# EasyEDA Pro project ProPrj_英才杯B题_2024-10-28.epro, board PCB1
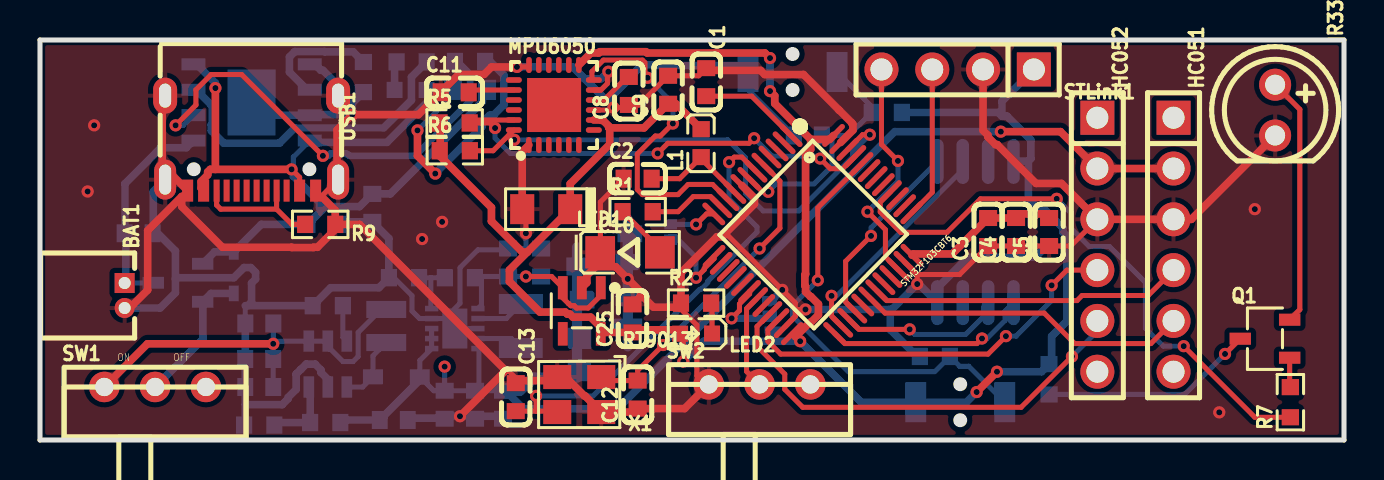
[diagram p1: board, top side]
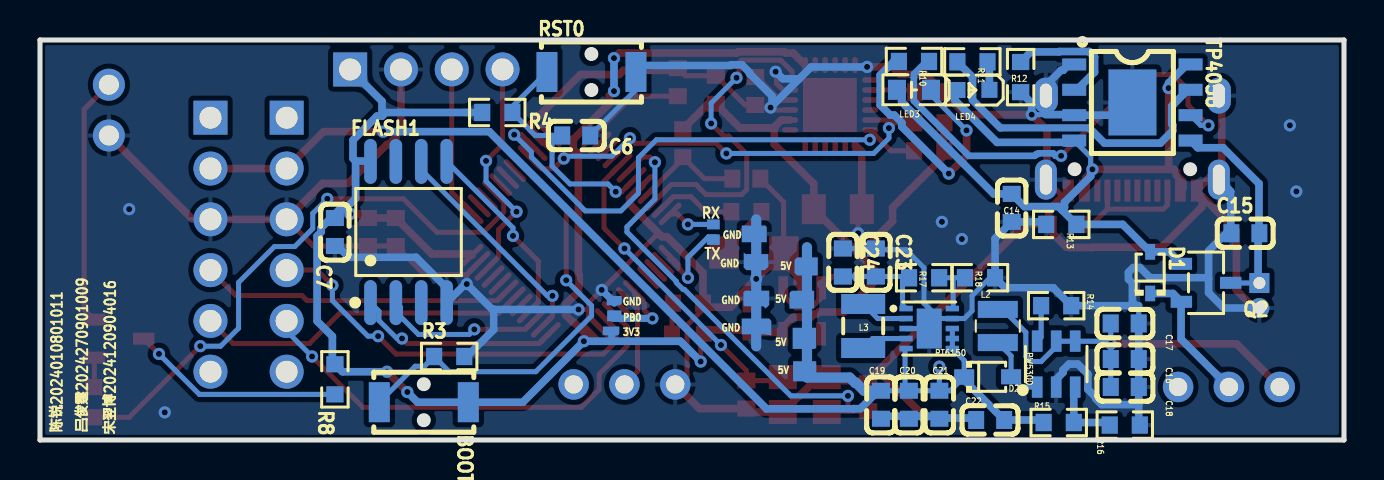
[diagram p2: board, bottom side, seen from below]

Outline 65.21 x 20 mm; copper layers: Top Layer, Bottom Layer. Coordinates in mm from the lower left corner of the outline.
Outline path: 0,20 0,0 65.21,0 65.21,20 0,20
Stack: Top Layer 0.035mm / Dielectric1 1.51mm FR4 er 4.5 / Bottom Layer 0.035mm

## Design rules (mm)
template: JLCPCB Capability(Two Layers Board)
spacing copperThickness1oz (default): track to track 0.102, other pairs 0.152 to 0.3
spacing copperThickness2oz: track to track 0.203, other pairs 0.152 to 0.3
track width copperThickness1oz (default): min 0.127, default 0.254, max 2.54
track width copperThickness2oz: min 0.203, default 0.254, max 2.54
differential pair differentialPair (default): width min 0.127, default 0.254, max 2.54; gap min 0.152, default 0.152
via viaSize (default): diameter min 0.5, default 0.61, max 10; hole min 0.3, default 0.305, max 6.3

## Placement (name value [footprint] x y rotation side)
BAT1  HC-1.25-2AW  [CONN-TH_2P-P1.25_HCTL_HC-1.25-2AW]  4.23 7.22 270 top
BOOT0  ZX-QC34-2TPDZ  [KEY-SMD_L3.9-W3.0-LS5.0-EH]  46.02 1.89 180 bottom
C1  100nF  [C0603]  33.32 17.89 270 top
C2  100nF  [C0603]  29.89 13.07 0 top
C3  100nF  [C0603]  47.41 10.4 90 top
C4  100nF  [C0603]  48.81 10.4 90 top
C5  100nF  [C0603]  50.46 10.4 90 top
C6  100nF  [C0603]  38.39 15.22 0 bottom
C7  100nF  [C0603]  50.46 10.4 90 bottom
C8  100nF  [C0603]  29.44 17.45 90 top
C9  100nF  [C0603]  31.41 17.51 90 top
C10  100nF  [CAP-SMD_L3.2-W1.6-FD]  25.31 11.54 180 top
C11  2.2uF  [C0603]  20.74 17.38 0 top
C12  12pF  [C0603]  29.89 2.27 90 top
C13  12pF  [C0603]  23.79 2.14 270 top
C14  10uF  [C0603]  16.62 11.61 90 bottom
C15  10uF  [C0603]  4.93 10.34 180 bottom
C16  100nF  [C0603]  10.96 4.05 0 bottom
C17  22uF  [C0603]  10.97 5.83 0 bottom
C18  22uF  [C0603]  10.96 2.65 0 bottom
C19  100nF  [C0603]  23.16 1.76 90 bottom
C20  22uF  [C0603]  21.76 1.76 90 bottom
C21  22uF  [C0603]  20.23 1.76 90 bottom
C22  10uF  [C0603]  17.69 1 180 bottom
C23  22uF  [C0603]  23.41 8.88 270 bottom
C24  1uF  [C0603]  25.06 8.88 270 bottom
C25  1uF  [C0603]  29.63 6.08 90 top
D1  B5817WS  [SOD-323_L1.7-W1.3-LS2.5-FD]  9.69 8.37 270 bottom
D2  1N5819WS  [SOD-323_L1.8-W1.3-LS2.5-RD]  17.82 3.16 180 bottom
FLASH1  W25Q16JVSSIQ  [SOIC-8_L5.3-W5.3-P1.27-LS8.0-BL]  46.78 10.4 180 bottom
HC051  PZ254V-11-06P  [HDR-TH_6P-P2.54-V-M]  56.68 9.76 270 top
HC052  PZ254V-11-06P  [HDR-TH_6P-P2.54-V-M]  52.87 9.76 270 top
IR333C  IR333C-A(BY)(Q)  [LED-TH_BD5.0-P2.54-FD]  61.76 16.49 270 top
L1  CBG160808U000T  [L0603]  33.06 14.84 90 top
L2  4.7uH  [IND-SMD_L2.5-W2.0-VLS252012CX-150M]  17.31 5.7 270 bottom
L3  2.2uH  [IND-SMD_L2.5-W2.0_MHCHL2520]  24.04 5.7 90 bottom
LED1  NCD1206R1  [LED1206-R-RD_RED]  29.51 9.38 0 top
LED2  NCD0603R1  [LED0603-RD_RED]  32.81 5.32 180 top
LED3  NCD0603G1  [led0603-rd_1]  21.5 17.51 0 bottom
LED4  NCD0603R1  [LED0603-RD_RED]  18.53 17.5 0 bottom
MPU6050  MPU-6050  [QFN-24_L4.0-W4.0-P0.50-BL-EP2.7]  25.7 16.75 0 top
NOREF  -  [Pad_e13922]  29.4 8.89 0 top
NOREF#2  -  [Pad_e13907]  26.98 5.08 0 top
NOREF#3  -  [Pad_e97]  36.65 5.45 0 top
NOREF#4  -  [Pad_e13924]  29.49 10.31 0 top
NOREF#5  -  [Pad_e13910]  29.38 5.68 0 top
NOREF#6  -  [Pad_e95]  36.49 6.97 0 top
NOREF#7  -  [Pad_e13905]  26.9 8.68 0 top
NOREF#8  -  [Pad_e13908]  26.97 3.44 0 top
NOREF#9  -  [Pad_e13906]  27.11 7.02 0 top
NOREF#10  -  [Pad_e96]  36.49 6.21 0 top
NOREF#11  -  [Pad_e13909]  29.39 7.08 0 top
NOREF#12  -  [Pad_e13888]  31.54 10.78 0 top
NOREF#13  -  [Pad_e13889]  31.54 10.02 0 top
PW5300  PW5300  [SOT-23-6_L2.9-W1.6-P0.95-LS2.8-BL]  14.39 3.8 180 bottom
Q1  S8050  [SOT-23-3_L2.9-W1.6-P1.90-LS2.8-BR]  61.26 5.06 0 top
Q2  CJ3401  [SOT-23-3_L2.9-W1.6-P1.90-LS2.8-BR]  6.9 7.86 0 bottom
R1  470Ω  [R0603]  29.89 11.41 0 top
R2  4.7kΩ  [R0603]  32.81 6.84 0 top
R3  10kΩ  [R0603]  44.74 4.18 180 bottom
R4  10kΩ  [R0603]  42.34 16.38 0 bottom
R5  4.7kΩ  [R0603]  20.73 15.85 0 top
R6  4.7kΩ  [R0603]  20.74 14.46 0 top
R7  1kΩ  [R0603]  62.52 1.89 90 top
R8  100Ω  [R0603]  50.46 3.03 90 bottom
R9  5.1kΩ  [R0603]  14.01 10.78 180 top
R10  4.7kΩ  [R0603]  21.5 18.93 0 bottom
R11  4.7kΩ  [R0603]  18.58 18.91 180 bottom
R12  4.7kΩ  [R0603]  16.17 18.15 90 bottom
R13  10kΩ  [R0603]  14.14 10.78 180 bottom
R14  30kΩ  [R0603]  14.39 6.72 0 bottom
R15  88.7kΩ  [R0603]  14.27 0.87 0 bottom
R16  12kΩ  [R0603]  10.96 0.75 0 bottom
R17  487kΩ  [R0603]  21 8.11 0 bottom
R18  86.6kΩ  [R0603]  18.2 8.11 0 bottom
RST0  ZX-QC34-2TPDZ  [KEY-SMD_L3.9-W3.0-LS5.0-EH]  37.63 18.4 180 bottom
RT6150  RT6150BGQW  [WSON-10_L2.5-W2.5-P0.50-BL-EP]  20.74 5.57 270 bottom
RT9013  RT9013-33GB  [SOT-23-5_L3.0-W1.7-P0.95-LS2.8-BL]  27.09 6.46 180 top
STLink1  PZ254V-11-04P  [HDR-TH_4P-P2.54-V-M]  45.89 18.53 180 top
STM32F103CBT6  STM32F103CBT6  [LQFP-48_L7.0-W7.0-P0.50-LS9.0-BL]  38.65 10.27 225.3 top
SW1  TA-3522-A3  [SW-TH_3P-L9.1-W3.5-P2.50-A3]  5.76 2.65 0 top
SW2  TA-3522-A3  [SW-TH_3P-L9.1-W3.5-P2.50-A3]  35.98 2.78 0 top
TP4056  TP4056-42-ESOP8  [ESOP-8_L4.9-W3.9-P1.27-LS6.0-BL-EP]  10.58 16.88 270 bottom
USB1  TYPE-C 16PIN 2MD(073)  [USB-C-SMD_TYPE-C-6PIN-2MD-073]  10.58 14.84 180 top
X1  8MHz  [OSC-SMD_4P-L3.2-W2.5-BL]  26.96 2.27 180 top

## Footprints (pads in the part's own frame, mm; a bottom-side part is the same pattern mirrored in y, then rotated)
C0603
  rect 0.8x0.9 smd: 1(-0.7,0) 2(0.7,0)
CAP-SMD_L3.2-W1.6-FD
  rect 1.2x1.5 smd: 1(-1.2,0) 2(1.2,0)
CONN-TH_2P-P1.25_HCTL_HC-1.25-2AW
  rect 1x1 hole 0.6: 1(-0.625,0)
  round 1 hole 0.6: 2(0.625,0)
ESOP-8_L4.9-W3.9-P1.27-LS6.0-BL-EP
  rect 0.6x1.2 smd: 1(-1.905,-2.909) 2(-0.635,-2.909) 3(0.635,-2.909) 4(1.905,-2.909) 5(1.905,2.909) 6(0.635,2.909) 7(-0.635,2.909) 8(-1.905,2.909)
  rect 3.3x2.4 smd: 9(0,0)
HDR-TH_4P-P2.54-V-M
  rect 1.7x1.7 hole 1.1: 1(-3.81,0)
  round 1.7 hole 1.1: 2(-1.27,0) 3(1.27,0) 4(3.81,0)
HDR-TH_6P-P2.54-V-M
  rect 1.7x1.7 hole 1.1: 1(-6.35,0)
  round 1.7 hole 1.1: 2(-3.81,0) 3(-1.27,0) 4(1.27,0) 5(3.81,0) 6(6.35,0)
IND-SMD_L2.5-W2.0-VLS252012CX-150M
  rect 0.85x2 smd: 1(-0.83,0) 2(0.83,0)
IND-SMD_L2.5-W2.0_MHCHL2520
  rect 1x2.2 smd: 1(-1.1,0) 2(1.1,0)
KEY-SMD_L3.9-W3.0-LS5.0-EH
  rect 1.05x2 smd: 1(-2.225,0) 2(2.225,0)
L0603
  rect 0.8x0.864 smd: 1(-0.7,0) 2(0.7,0)
led0603-rd_1
  rect 0.9x1 smd: 1(-0.85,0) 2(0.85,0)
LED0603-RD_RED
  rect 0.8x0.8 smd: 1(-0.799,-0.004) 2(0.799,0.004)
LED1206-R-RD_RED
  rect 1.485x1.62 smd: 1(1.492,0) 2(-1.492,0)
LED-TH_BD5.0-P2.54-FD
  round 1.6 hole 1: 1(-1.27,0) 2(1.27,0)
LQFP-48_L7.0-W7.0-P0.50-LS9.0-BL
  oval 0.27x1.5 smd: 1(-2.75,-4.25) 2(-2.25,-4.25) 3(-1.75,-4.25) 4(-1.25,-4.25) 5(-0.75,-4.25) 6(-0.25,-4.25) 7(0.25,-4.25) 8(0.75,-4.25) 9(1.25,-4.25) 10(1.75,-4.25) 11(2.25,-4.25) 12(2.75,-4.25) 25(2.75,4.25) 26(2.25,4.25) 27(1.75,4.25) 28(1.25,4.25) 29(0.75,4.25) 30(0.25,4.25) 31(-0.25,4.25) 32(-0.75,4.25) 33(-1.25,4.25) 34(-1.75,4.25) 35(-2.25,4.25) 36(-2.75,4.25)
  oval 1.5x0.27 smd: 13(4.25,-2.75) 14(4.25,-2.25) 15(4.25,-1.75) 16(4.25,-1.25) 17(4.25,-0.75) 18(4.25,-0.25) 19(4.25,0.25) 20(4.25,0.75) 21(4.25,1.25) 22(4.25,1.75) 23(4.25,2.25) 24(4.25,2.75) 37(-4.25,2.75) 38(-4.25,2.25) 39(-4.25,1.75) 40(-4.25,1.25) 41(-4.25,0.75) 42(-4.25,0.25) 43(-4.25,-0.25) 44(-4.25,-0.75) 45(-4.25,-1.25) 46(-4.25,-1.75) 47(-4.25,-2.25) 48(-4.25,-2.75)
OSC-SMD_4P-L3.2-W2.5-BL
  rect 1.4x1.2 smd: 1(-1.1,-0.875) 2(1.1,-0.875) 3(1.1,0.875) 4(-1.1,0.875)
Pad_e95
  custom 0.754x0.467 smd far side: 1(0,0)
Pad_e96
  custom 0.711x0.544 smd far side: 58(0,0)
Pad_e97
  custom 0.836x0.446 smd far side: 59(0,0)
Pad_e13888
  custom 0.635x0.508 smd far side: 1(0,0)
Pad_e13889
  custom 0.643x0.524 smd far side: 49(0,0)
Pad_e13905
  custom 1.155x0.903 smd far side: 50(0,0)
Pad_e13906
  custom 1.232x0.889 smd far side: 51(0,0)
Pad_e13907
  custom 1.175x1.054 smd far side: 52(0,0)
Pad_e13908
  custom 1.155x0.994 smd far side: 53(0,0)
Pad_e13909
  custom 1.289x0.895 smd far side: 54(0,0)
Pad_e13910
  custom 1.48x0.843 smd far side: 55(0,0)
Pad_e13922
  custom 1.232x0.889 smd far side: 56(0,0)
Pad_e13924
  custom 1.243x0.833 smd far side: 57(0,0)
QFN-24_L4.0-W4.0-P0.50-BL-EP2.7
  oval 0.28x0.8 smd: 1(-1.25,-2) 2(-0.75,-2) 3(-0.25,-2) 4(0.25,-2) 5(0.75,-2) 6(1.25,-2) 13(1.25,2) 14(0.75,2) 15(0.25,2) 16(-0.25,2) 17(-0.75,2) 18(-1.242,2)
  oval 0.8x0.28 smd: 7(2,-1.25) 8(2,-0.75) 9(2,-0.25) 10(2,0.25) 11(2,0.75) 12(2,1.25) 19(-2,1.25) 20(-2,0.75) 21(-2,0.25) 22(-2,-0.25) 23(-2,-0.75) 24(-2,-1.25)
  rect 2.7x2.7 smd: 25(0.013,0)
R0603
  rect 0.806x0.864 smd: 1(-0.753,0) 2(0.753,0)
SOD-323_L1.7-W1.3-LS2.5-FD
  rect 0.78x0.5 smd: 1(-1.04,0) 2(1.04,0)
SOD-323_L1.8-W1.3-LS2.5-RD
  rect 1x0.75 smd: 1(-1.173,0) 2(1.173,0)
SOIC-8_L5.3-W5.3-P1.27-LS8.0-BL
  oval 0.63x2.25 smd: 1(-1.905,-3.53) 2(-0.635,-3.53) 3(0.635,-3.53) 4(1.905,-3.53) 5(1.905,3.53) 6(0.635,3.53) 7(-0.635,3.53) 8(-1.905,3.53)
SOT-23-3_L2.9-W1.6-P1.90-LS2.8-BR
  rect 1.07x0.6 smd: 1(1.235,-0.95) 2(1.235,0.95) 3(-1.235,0)
SOT-23-5_L3.0-W1.7-P0.95-LS2.8-BL
  rect 0.49x1.157 smd: 1(-0.95,-1.153) 2(0,-1.153) 3(0.95,-1.153)
  rect 0.49x1.175 smd: 4(0.95,1.153) 5(-0.95,1.153)
SOT-23-6_L2.9-W1.6-P0.95-LS2.8-BL
  rect 0.532x1.072 smd: 1(-0.95,-1.149) 2(0,-1.149) 3(0.95,-1.149) 4(0.95,1.149) 5(0,1.149) 6(-0.95,1.149)
SW-TH_3P-L9.1-W3.5-P2.50-A3
  round 1.524 hole 0.914: 1(-2.54,0) 2(0,0) 3(2.54,0)
USB-C-SMD_TYPE-C-6PIN-2MD-073
  rect 0.55x1.1 smd: 1(-3.2,2.375) 2(-2.4,2.375) 11(2.4,2.375) 12(3.2,2.375)
  rect 0.3x1.1 smd: 3(-1.75,2.375) 4(-1.25,2.375) 5(-0.75,2.375) 6(-0.25,2.375) 7(0.25,2.375) 8(0.75,2.375) 9(1.25,2.375) 10(1.75,2.375)
  oval 1.1x2 hole 0.6x1.5: 13(-4.325,1.825) 14(4.325,1.825)
  oval 1.2x1.8 hole 0.6x1.2: 13(-4.325,-2.375) 14(4.325,-2.375)
WSON-10_L2.5-W2.5-P0.50-BL-EP
  rect 0.28x0.665 smd: 1(-1,-1.157) 2(-0.5,-1.157) 3(0,-1.157) 4(0.5,-1.157) 5(1,-1.157) 6(1,1.157) 7(0.5,1.157) 8(0,1.157) 9(-0.5,1.157) 10(-1,1.157)
  rect 2x1.25 smd: 11(0,0)

## Nets
As in the schematic, except:
3V3: BOOT0.2 C3.2 C4.2 C5.2 C7.2 C9.1 C10.1 C25.1 FLASH1.8 L1.2 LED2.2 MPU6050.8 MPU6050.13 NOREF#3.59 R4.2 R5.1 R6.1 R8.2 RT9013.5 STLink1.1 STM32F103CBT6.24 STM32F103CBT6.36 STM32F103CBT6.48
+5V: C19.2 C20.2 C21.2 C22.2 D2.1 HC051.2 HC052.2 NOREF#2.52 NOREF#7.50 NOREF#8.53 NOREF#9.51 R15.2 RT6150.5 RT6150.6 RT6150.7 RT6150.8
GND: BAT1.2 C1.1 C2.1 C3.1 C4.1 C5.1 C6.1 C7.1 C8.1 C9.2 C10.2 C11.1 C12.1 C13.1 C14.1 C15.1 C16.1 C17.1 C18.1 C19.1 C20.1 C21.1 C22.1 C23.1 C24.1 C25.2 FLASH1.4 HC051.3 HC052.3 IR333C.2 LED1.2 MPU6050.1 MPU6050.9 MPU6050.11 MPU6050.18 NOREF.56 NOREF#4.57 NOREF#5.55 NOREF#6.1 NOREF#11.54 PW5300.2 R2.1 R3.2 R9.1 R12.1 R13.1 R14.1 R16.1 R18.1 RST0.2 RT6150.3 RT6150.9 RT6150.11 RT9013.2 STLink1.2 STM32F103CBT6.8 STM32F103CBT6.23 STM32F103CBT6.35 STM32F103CBT6.47 SW2.1 TP4056.1 TP4056.3 TP4056.9 USB1.1 USB1.12 USB1.13 USB1.14 X1.2 X1.4
$1N10982: NOREF#12.1 STM32F103CBT6.12
$1N10986: NOREF#13.49 STM32F103CBT6.13
$1N11000: NOREF#10.58 STM32F103CBT6.18

Pads without a net: FLASH1 3 7; HC051 1 6; HC052 1 6; MPU6050 2 3 4 5 6 7 14 15 16 17 19 21 22 25; RT9013 4; STM32F103CBT6 2 3 4 14 15 16 17 20 32 33 38 39 41 42 43; SW1 3; SW2 3; USB1 3 5 6 7 8 9

## Via types
v1: diameter 0.61, hole 0.305, Top Layer to Bottom Layer, 62 vias

## Routing (per net, layer and track width the routed paths; a pad name or vN(x,y) marks a point on that pad's centre or on a via; arc(x,y) is an arc through that point)
3V3: length 116.5
  Top Layer w0.249: 32.04,5.29 32.17,5.15 v1(32.17,3.92) ; v1(38.01,4.94) 38,4.94 37.77,5.16 37.62,5.32
  Top Layer w0.254: RT9013.5 28.11,5.38 28.3,5.38
  Top Layer w0.381: v1(36.51,17.44) 36.74,17.21 36.74,16.83 38.54,15.03 ; 24.37,9.4 23.47,8.5 23.47,7.92 25,6.4 26.27,6.4 26.37,6.3 26.5,6.3 26.65,6.14 27.54,6.14 28.3,5.38 C25.1 29.76,5.51 31.94,5.51 32.01,5.44 LED2.2 ; 24.37,9.4 24.12,9.4 22.57,10.94 22.57,11.62 20.02,14.18 20.02,15.82 R5.1 ; 24.37,9.4 C10.1 26.51,12.81 28.49,14.79 28.49,15.57 28.46,15.61 ; v1(36.51,19.09) 36.25,19.35 30.36,19.35 30.3,19.41 28,19.41 27.93,19.35 27.55,19.35 MPU6050.13 ; 38.54,15.03 38.54,14.52 38.28,14.27 38.28,8.29 38.25,8.25 38.25,7.72 38.28,7.68 38.28,7.41 38.52,7.17 38.55,7.17 38.92,6.79 38.92,6.26 38.55,5.88 38.5,5.88 37.77,5.16 ; 38.54,15.03 39.48,15.03 STM32F103CBT6.48 ; 28.46,15.61 30.2,15.61 C9.1 31.79,16.81 L1.2 ; 28.46,15.61 28.44,15.63 28.44,15.7 28.16,15.98 28.08,15.98 28.06,16 MPU6050.8 ; v1(46.84,2.4) v1(47.85,3.41) ; 43.61,9.24 43.67,9.3 45.62,9.3 C3.2 C4.2 49.02,11.3 v1(49.69,11.3) 50.25,11.3 C5.2
  Bottom Layer w0.254: 49.94,11.56 v1(49.69,11.3)
  Bottom Layer w0.355: 36.55,4.94 36.62,5 36.62,5.45
  Bottom Layer w0.381: 49.43,13.95 49.55,14.07 49.55,15 48.36,16.19 48.1,16.19 ; 49.43,13.95 49.43,12.08 49.94,11.56 50.2,11.56 51.15,10.61 51.15,10.4 51.35,10.2 51.35,5.95 50.59,5.18 50.59,3.91 R8.2 50.09,3.41 v1(47.85,3.41) ; 49.43,13.95 48.7,13.95 FLASH1.8 ; v1(32.17,3.92) 33.19,4.94 v1(38.01,4.94) 41.06,1.89 BOOT0.2 46.33,1.89 v1(46.84,2.4) ; 48.1,16.19 47.92,16.38 R4.2 ; 48.1,16.19 48.1,16.93 STLink1.1 ; v1(36.51,17.44) v1(36.51,19.09)
+5V: length 66.2
  Top Layer w0.381: HC051.2 HC052.2 51.03,15.42 v1(48.05,15.42)
  Bottom Layer w0.252: D2.1 18.99,3.98 RT6150.6 RT6150.7 RT6150.8 ; RT6150.5 21.95,4.52 21.95,2.46
  Bottom Layer w0.254: C19.2 C20.2 C21.2 ; C21.2 19.69,2.46 D2.1 ; C21.2 v1(20.23,3.67)
  Bottom Layer w0.381: v1(48.05,15.42) 42.74,15.42 28.88,1.56 24.54,1.56 24.53,1.56 24.18,1.56 23.28,2.46 C19.2 ; 19.2,2.96 18.95,2.96 C22.2 15.15,1 R15.2
  Bottom Layer w0.508: 23.28,2.46 24,2.46 24.39,2.85 24.45,2.85 24.72,3.12 26.85,3.12 26.85,9.64
GND: length 265.1
  Top Layer w0.249: 34.15,10.21 34.42,10.21 v1(37.12,7.51) 37.77,6.85 37.77,6.53 ; 37.77,6.53 37.77,6.18 STM32F103CBT6.23 ; 37.77,6.53 v1(38.28,6.53) ; v1(43.87,7.8) 43.87,8.27 STM32F103CBT6.35
  Top Layer w0.252: MPU6050.18 24.36,18.65 v1(23.85,18.65) ; C8.1 29.31,16.62 v1(28.67,16.62) 28.55,16.5 MPU6050.9 ; 23.29,3.47 23.41,3.47 23.92,2.97
  Top Layer w0.254: 25.56,2.97 25.74,3.15 X1.2 ; 43.87,8.27 45.98,8.27 C3.1 C4.1 C5.1 51.54,9.7 HC052.3 ; USB1.13 14.85,12.97 14.09,12.2 14.09,12.16 USB1.1 ; C8.1 29.95,16.75 C9.2 32.93,18.21 C1.1 ; C2.1 28.02,11.9 28.02,9.37 LED1.2 ; C10.2 24.3,11.36 v1(24.3,10.34) ; R2.1 32,6.59 32.85,5.74 32.85,3.2 33.36,2.69 SW2.1 ; 7.09,12.18 USB1.12 ; v1(28.42,18.41) 28.37,18.37 28.37,17.83 28.05,17.5 MPU6050.11
  Top Layer w0.381: 33.2,18.48 36.03,18.48 36.24,18.27 38.18,18.27 39.96,16.49 ; 39.95,16.49 39.96,16.49 ; 39.96,16.49 40.59,15.86 40.59,15.85 40.65,15.79 40.65,15.49 STM32F103CBT6.47 ; 14.09,12.16 14.76,11.49 R9.1 ; 35.1,12.73 35.73,12.1 35.73,11.8 35.1,11.17 35.1,11.16 34.15,10.21 34.1,10.16 33.85,10.16 32.05,8.37 R2.1 ; 30.19,7.13 29.98,7.13 C25.2 ; 30.19,7.13 30.19,7.26 v1(29.39,8.05) 28.78,8.66 27.78,8.66 27.35,8.23 27.35,7.87 RT9013.2 ; 30.19,7.13 30.68,6.64 31.95,6.64 32,6.59 ; USB1.14 6.11,17.07 6.11,13.74 USB1.12 ; R9.1 14.76,10.53 13.88,9.64 13.69,9.64 13.68,9.62 12.59,9.62 12.57,9.64 9.12,9.64 7.09,11.67 7.09,12.18 5.38,10.47 5.38,7.5 4.49,6.6 BAT1.2 ; R9.1 15.98,10.78 23.29,3.47 v1(21,1.19) ; STLink1.2 47.16,15.48 47.4,15.24 47.4,15.15 47.78,14.77 47.87,14.77 49.81,12.83 51.08,12.83 HC052.3 HC051.3 57.57,11.03 IR333C.2 ; X1.2 25.98,3.03 26.39,3.03 27.22,2.2 27.26,2.2 28.07,1.4 29.71,1.4 C12.1 32.23,1.57 33.36,2.69 ; 23.92,2.97 25.56,2.97 ; C10.2 24.11,14.42 MPU6050.1 ; 14.85,12.97 14.85,15.51 v1(15.62,16.27) 18.92,16.27 C11.1 20.94,18.28 22.21,18.28 22.58,18.65 v1(23.85,18.65)
  Bottom Layer w0.249: 44.78,6.96 FLASH1.4
  Bottom Layer w0.252: 28.6,16.69 v1(28.67,16.62) ; 20.24,6.07 RT6150.9 18.98,6.07 18.6,6.45 18.6,7.22 17.7,8.11 R18.1 ; 20.24,6.07 21,6.83 21,8.61 21.9,9.51 23.35,9.51 C23.1 ; 20.24,6.07 RT6150.11 RT6150.3
  Bottom Layer w0.254: 21.76,1.19 C20.1 ; RST0.2 35.41,17.51 C6.1 ; 10.27,6.72 C17.1 ; C23.1 24.3,9.58 ; 24.3,9.58 C24.1 ; 24.3,9.58 v1(24.3,10.34) ; USB1.13 14.92,17.21 14.92,16.27 v1(15.62,16.27)
  Bottom Layer w0.355: 36.49,6.84 36.49,6.88 v1(37.12,7.51)
  Bottom Layer w0.381: 10.27,1.77 10.27,0.8 R16.1 ; 10.27,1.77 C17.1 ; 10.27,1.77 12.11,1.77 12.41,2.06 12.41,2.13 12.81,2.53 12.81,3.29 12.83,3.32 12.83,3.32 13.03,3.52 13.04,3.52 13.31,3.8 13.76,3.8 14.05,3.5 14.05,3.37 14.39,3.03 PW5300.2 ; 27.24,18.06 26.64,18.65 v1(23.85,18.65) ; 27.24,18.06 28.07,18.06 v1(28.42,18.41) ; 27.24,18.06 28.6,16.69 28.6,17.2 29.73,18.33 29.73,18.38 30.11,18.76 30.64,18.76 30.68,18.73 35.08,18.73 RST0.2 ; R13.1 15.02,10.91 C14.1 17.45,10.07 R18.1 16.95,7.61 14.54,7.61 R14.1 10.39,6.72 ; R12.1 15.62,16.84 v1(15.62,16.27) ; 6.77,8.06 6.77,7.36 6.01,6.6 BAT1.2 ; 6.77,8.06 6.77,9.45 5.67,10.56 5.67,12.43 USB1.14 ; 6.77,8.06 6.83,8.11 9.69,8.11 10.2,8.62 10.54,8.62 10.78,8.38 10.78,8.04 10.58,7.84 10.58,6.9 10.39,6.72 ; 42.52,6.53 42.6,6.53 v1(43.87,7.8) 43.94,7.8 44.78,6.96 44.78,7.52 46.4,9.14 49.77,9.14 50.33,9.7 C5.1 ; 42.52,6.53 42.52,5.52 43.86,4.18 R3.2 ; 42.52,6.53 v1(38.28,6.53) ; 14.92,17.21 15.04,17.34 15.04,17.59 14.15,18.49 14.04,18.49 13.74,18.78 TP4056.1 ; 14.92,16.27 13.52,16.27 13.49,16.24 11.22,16.24 TP4056.9 ; 10.39,6.72 10.27,6.72 ; C19.1 23.03,1.19 v1(21,1.19) 20.36,1.19 20.27,1.1 18.49,1.1 C22.1
  Bottom Layer w0.508: 29.39,4.68 v1(29.39,8.05) 29.39,11.03
  vias: v1(2.38,12.43) v1(2.71,15.73) v1(19.11,10.05) v1(20.11,10.91) v1(58.97,1.38) v1(60.75,11.54)
VBAT_E: length 5.1
  Top Layer w0.249: C1.2 35.58,17.19 STM32F103CBT6.1
VCC_USB: length 42.4
  Top Layer w0.254: USB1.2 12.98,13.13 v1(12.58,13.53)
  Top Layer w0.381: 8.77,13.53 v1(8.77,17.6) ; 8.77,13.53 v1(12.58,13.53) ; 8.77,13.53 8.52,13.53 8.38,13.4 8.38,13.25 8.05,12.92 8.05,12.6 USB1.11
  Bottom Layer w0.254: TP4056.4 12.67,14.15 12.67,13.44 v1(12.58,13.53)
  Bottom Layer w0.381: 14.11,11.5 14.27,11.67 15.98,11.67 C14.2 17.52,12.31 21.93,16.72 21.93,16.73 22.12,16.92 22.12,17.28 LED3.2 ; 14.11,11.5 13.98,11.63 13.98,11.88 12.67,13.19 12.67,13.44 ; 14.11,11.5 R13.2 11.07,10.78 D1.1 8.73,9.41 Q2.1 ; 19.33,17.5 19.46,17.37 19.46,16.99 17.35,14.88 13.9,14.88 13.87,14.84 13.62,14.84 TP4056.4 ; v1(8.77,17.6) 8.77,17.85 7.87,18.75 7.71,18.75 TP4056.8
BOOT0: length 22.1
  Top Layer w0.249: v1(38.89,7.99) 38.89,11.61 STM32F103CBT6.44
  Bottom Layer w0.249: R3.1 44.74,3.41 40.42,3.41 37.62,6.21 37.62,6.72 v1(38.89,7.99)
  Bottom Layer w0.254: BOOT0.1 46.44,3.69 45.99,3.69 R3.1
EXIT0_6050: length 16.4
  Top Layer w0.249: 34.4,12.02 33.63,12.78 32.41,12.78 31.9,12.27 30.12,12.27 29.87,12.52 29.87,14.3 30.77,15.2 31.02,15.2 v1(31.65,15.83) ; v1(30.38,18.11) 30.25,18.24 30.25,18.87 30.13,19 28.17,19 27.6,18.42 27.6,18.09 MPU6050.12
  Bottom Layer w0.249: v1(31.65,15.83) 31.65,16.84 v1(30.38,18.11)
I2C1_SCL: length 23.7
  Top Layer w0.249: v1(30.88,14.33) 31.39,14.84 35.46,14.84 v1(35.71,15.09) ; v1(22.76,15.6) 22.5,15.85 R5.2 ; STM32F103CBT6.45 40.14,13.57 39.52,13.57 v1(39.01,14.07)
  Top Layer w0.252: R5.2 21.63,16 MPU6050.23
  Bottom Layer w0.249: v1(39.01,14.07) 38.89,14.19 36.61,14.19 v1(35.71,15.09) ; v1(30.88,14.33) 23.52,14.33 22.76,15.09 v1(22.76,15.6)
I2C1_SDA: length 26.4
  Top Layer w0.249: 23.46,15.27 v1(23.71,15.01) ; 40.39,14.52 41.13,15.27 v1(41.49,15.27)
  Top Layer w0.252: R6.2 22.66,14.46 MPU6050.24
  Bottom Layer w0.249: v1(41.49,15.27) 40.63,14.4 40.63,14.15 37.94,11.45 36.16,11.45 35.28,12.33 35.28,14.11 34.38,15.01 v1(23.71,15.01)
IR: length 29.2
  Top Layer w0.249: v1(50.84,12.06) 47.03,12.06 45.36,10.38 43.03,10.38 42.02,11.4 42.02,11.91 STM32F103CBT6.40 ; R7.1 60.75,1.14 v1(57.19,4.69)
  Bottom Layer w0.249: v1(57.19,4.69) 56.17,4.69 55.28,5.59 55.28,7.88 53.48,9.67 52.46,9.67 51.57,10.57 51.57,11.33 v1(50.84,12.06)
NRST: length 12.2
  Top Layer w0.249: v1(36.42,12.41) 36.12,12.41 STM32F103CBT6.7
  Bottom Layer w0.249: 39.6,15.22 39.6,13.7 38.7,12.8 36.81,12.8 v1(36.42,12.41)
  Bottom Layer w0.254: C6.2 40.44,15.22 41.59,16.38 41.59,16.67 RST0.1
OSC_IN: length 16
  Top Layer w0.249: STM32F103CBT6.5 37,12.95 37,10.59 v1(35.98,9.58) ; v1(31.16,4.75) 29.89,3.48 C12.2
  Top Layer w0.254: 28.07,3.15 28.24,2.97 C12.2
  Bottom Layer w0.249: v1(31.16,4.75) v1(35.98,9.58)
OSC_OUT: length 23
  Top Layer w0.249: v1(34.46,13.89) 34.71,14.14 35.1,14.14 STM32F103CBT6.6 ; 24.81,1.44 v1(24.81,2.21)
  Top Layer w0.254: X1.3 25.82,1.44 23.92,1.44
  Bottom Layer w0.254: v1(24.81,2.21) 27.66,2.21 32.98,7.53 33.05,7.53 33.39,7.87 33.39,7.94 35.86,10.4 35.86,10.65 34.46,12.05 v1(34.46,13.89)
PA1_LED: length 3.9
  Top Layer w0.249: 34.05,11.66 33.54,12.17 32.66,12.17 31.91,11.41 R1.2
PB1: length 4.8
  Top Layer w0.249: 35.84,7.07 35.33,6.57 35.33,3.43 SW2.2
SPI2_MISO: length 8.2
  Top Layer w0.249: v1(43.49,5.53) 40.95,5.53 STM32F103CBT6.27
  Bottom Layer w0.249: v1(43.49,5.53) 43.74,5.28 46.28,5.28 47.18,6.18 47.18,6.64 FLASH1.2
SPI2_MOSI: length 9.6
  Top Layer w0.249: 40.79,6.4 40.29,6.9 40.29,8.94 v1(41.55,10.21)
  Bottom Layer w0.249: v1(41.55,10.21) 41.55,10.61 FLASH1.5
SPI2_SCK: length 11.3
  Top Layer w0.249: STM32F103CBT6.26 39.58,6.19 v1(39.58,7.21)
  Bottom Layer w0.249: v1(39.58,7.21) 39.84,7.21 46.12,13.49 46.12,13.91 FLASH1.6
SYS_JTCK-SWCLK: length 7.6
  Top Layer w0.249: STM32F103CBT6.37 44.62,12.39 STLink1.3
SYS_JTMS-SWDIO: length 11.6
  Top Layer w0.249: 42.9,8.53 42.28,9.16 42.28,10.52 v1(41.38,11.41) ; v1(42.9,13.95) 42.08,14.78 STLink1.4
  Bottom Layer w0.249: v1(41.38,11.41) 42.9,12.94 v1(42.9,13.95)
USART1_RX: length 15.7
  Top Layer w0.249: HC051.4 55.41,7.22 52.11,7.22 51.86,6.97 42.34,6.97 41.85,7.46
USART1_TX: length 16.6
  Top Layer w0.249: HC051.5 55.55,4.82 51.74,4.82 50.22,6.34 42.26,6.34 STM32F103CBT6.30
USART3_RX: length 20.2
  Top Layer w0.249: 36.91,6.02 36.4,5.51 36.4,4.94 37.04,4.29 47.4,4.29 v1(48.3,5.19) ; HC052.4 51.35,8.49 v1(50.59,7.73)
  Bottom Layer w0.249: v1(50.59,7.73) 50.59,6.97 48.81,5.19 v1(48.3,5.19)
USART3_TX: length 22.8
  Top Layer w0.249: STM32F103CBT6.21 35.86,5.68 35.86,4.68 37.24,3.3 37.24,2.53 38.14,1.64 49.06,1.64 v1(51.6,4.18)
  Bottom Layer w0.249: HC052.5 52.87,5.45 v1(51.6,4.18)
W25Q16_CHIP_SELECT: length 10.3
  Top Layer w0.249: STM32F103CBT6.25 40.25,4.82 46.85,4.82 v1(47.1,5.07)
  Bottom Layer w0.249: v1(47.1,5.07) 47.36,5.07 48.26,5.97 48.26,6.44 FLASH1.1
$1N1001: length 5.4
  Top Layer w0.249: L1.1 33.06,14.06 STM32F103CBT6.9
  Top Layer w0.254: C2.2 31.98,13.07 L1.1
$1N2026: length 2.8
  Top Layer w0.254: LED1.1 31,9.55 R1.1
$1N2257: length 1.5
  Top Layer w0.254: R2.2 33.61,6.8 LED2.1
$1N3506: length 2.2
  Top Layer w0.252: MPU6050.10 28.2,17 29.36,18.15 C8.2
$1N4122: length 2.3
  Top Layer w0.252: MPU6050.20 21.55,17.5 C11.2
$1N5475: length 1.5
  Top Layer w0.254: R7.2 62.49,2.68 Q1.1
$1N5549: length 12.5
  Top Layer w0.254: 61.76,17.77 63,16.53 63,6.52 Q1.2
$1N5650: length 10.7
  Top Layer w0.254: Q1.3 v1(59.26,4.3)
  Bottom Layer w0.254: R8.1 57.23,2.28 v1(59.26,4.3)
$1N6695: length 6.5
  Top Layer w0.254: 11.83,11.54 USB1.4 ; 11.83,11.54 9.04,11.54 8.83,11.75 USB1.10 ; 11.83,11.54 12.59,10.78 R9.2
$1N7198: length 15.9
  Bottom Layer w0.355: 17.19,15.61 12.74,15.61
  Bottom Layer w0.381: TP4056.7 7.8,17.51 8.56,16.75 8.56,16.74 8.62,16.68 8.62,15.8 8.56,15.75 8.56,15.47 9.18,14.84 11.98,14.84 12.74,15.61 ; 17.19,15.61 18.57,16.99 18.57,18.15 R11.1
$1N7334: length 13
  Top Layer w0.381: v1(19.77,13.32) 18.88,14.21 v1(18.88,15.48)
  Bottom Layer w0.254: v1(18.88,15.48) 20.65,17.26 LED3.1
  Bottom Layer w0.381: v1(19.77,13.32) 22.11,15.66 22.11,15.87 22.49,16.24 22.69,16.24 23.19,16.75 23.19,18.24 22.51,18.93 R10.2
$1N7338: length 22.6
  Top Layer w0.254: v1(14.15,14.21) 10.08,18.27 8.56,18.27 7.8,17.51 7.8,16.75 v1(6.78,15.73)
  Bottom Layer w0.254: v1(6.78,15.73) 7.17,15.73 7.67,16.24
  Bottom Layer w0.33: R10.1 20.88,18.93 21.5,18.3 21.5,18.13 21.51,18.13 21.51,16.96 18.76,14.21 15.47,14.21 15.38,14.3 15.3,14.3 15.27,14.34 14.55,14.34 14.42,14.21 v1(14.15,14.21)
$1N7377: length 1.4
  Bottom Layer w0.381: LED4.1 17.73,18.81 R11.2
$1N7557: length 6.2
  Bottom Layer w0.381: R12.2 15.66,19.41 14.25,19.41 14.23,19.42 12.75,19.42 12.73,19.41 12.73,19.41 12.47,19.15 12.47,18.39 13.35,17.51 TP4056.2
$1N8006: length 10.7
  Bottom Layer w0.254: BAT1.1 5.65,7.85 Q2.3
  Bottom Layer w0.381: 4.3,7.85 4.3,10.27 4.25,10.32 4.25,12.82 6.05,14.61 7.32,14.61 TP4056.5
$1N8100: length 7
  Bottom Layer w0.381: D1.2 8.55,7.33 8.15,6.92 8.15,5.04 SW1.2
$1N8818: length 1.9
  Bottom Layer w0.254: PW5300.6 15.15,5.14 R14.2
$1N8927: length 20.5
  Top Layer w0.381: v1(11.66,4.81) 5.38,4.81 SW1.1
  Bottom Layer w0.254: C18.2 C16.2 v1(11.66,4.81) 11.66,4.94 ; 11.66,4.94 14.39,4.94 14.39,4.68 15.15,3.92 15.66,3.92 15.91,4.18 15.91,5.38 16.81,6.28 17.06,6.28 L2.1 ; 11.66,4.94 11.66,5.82
$1N9016: length 3.5
  Bottom Layer w0.254: PW5300.1 16.13,2.65 D2.2 16.65,4.21 L2.2
$1N9241: length 3.6
  Bottom Layer w0.381: PW5300.3 13.51,2.58 R15.1 11.84,0.87 R16.2
$1N9982: length 2.3
  Bottom Layer w0.252: L3.1 23.57,5.07 RT6150.4
$1N9986: length 2.4
  Bottom Layer w0.252: L3.2 23.32,6.07 RT6150.2
$1N10250: length 2.8
  Bottom Layer w0.252: RT6150.10 19.54,6.61 19.54,8.11
  Bottom Layer w0.254: R18.2 R17.1
$1N10837: length 10.4
  Top Layer w0.254: v1(24.3,8.17) 25.58,8.17 RT9013.3 26.14,7.11 26.43,6.82 26.44,6.82 26.54,6.72 26.71,6.72 26.83,6.6 27.41,6.6 28.04,7.23 RT9013.1
  Bottom Layer w0.252: 22.08,8.17 22.08,6.75 RT6150.1
  Bottom Layer w0.254: C24.2 v1(24.3,8.17) C23.2 21.81,8.17 R17.2
$1N10982: length 2.5
  Top Layer w0.254: v1(32.81,10.78) 33.33,11.3 STM32F103CBT6.12
  Bottom Layer w0.254: v1(32.81,10.78) 31.41,10.78
$1N10986: length 4.3
  Top Layer w0.254: v1(32.81,8.11) 33.21,8.52 33.21,8.58 33.71,9.07 STM32F103CBT6.13
  Bottom Layer w0.254: v1(32.81,8.11) 32.81,9.13 31.79,10.14 31.41,10.14
$1N11000: length 3.7
  Top Layer w0.254: v1(34.58,6.08) 34.98,6.47 34.98,6.8 35.48,7.31 STM32F103CBT6.18
  Bottom Layer w0.355: v1(34.58,6.08) 36.55,6.08

## Copper pours and planes (outline as drawn; the poured copper is in the pictures)
GND on Top Layer: -1.61,21.83 68.11,21.83 68.11,-3.83 -1.61,-3.83
GND on Bottom Layer: -3.01,22.84 67.99,22.84 67.99,-4.33 -3.01,-4.33

Small or netless copper shapes (teardrops, artwork), in the pictures only: 21 on Top Layer, 8 on Bottom Layer

## Text on the board
Bottom Silkscreen Layer: 5V | GND | PB0 | 3V3 | TX | RX | 宋翌博2024120904016 | 吕俊霆2024270901009 | 陈锐2024010801011
Top Silkscreen Layer: ON | OFF
